# EAGLE design Gerador de Sinais (EAGLE 7.4.0)
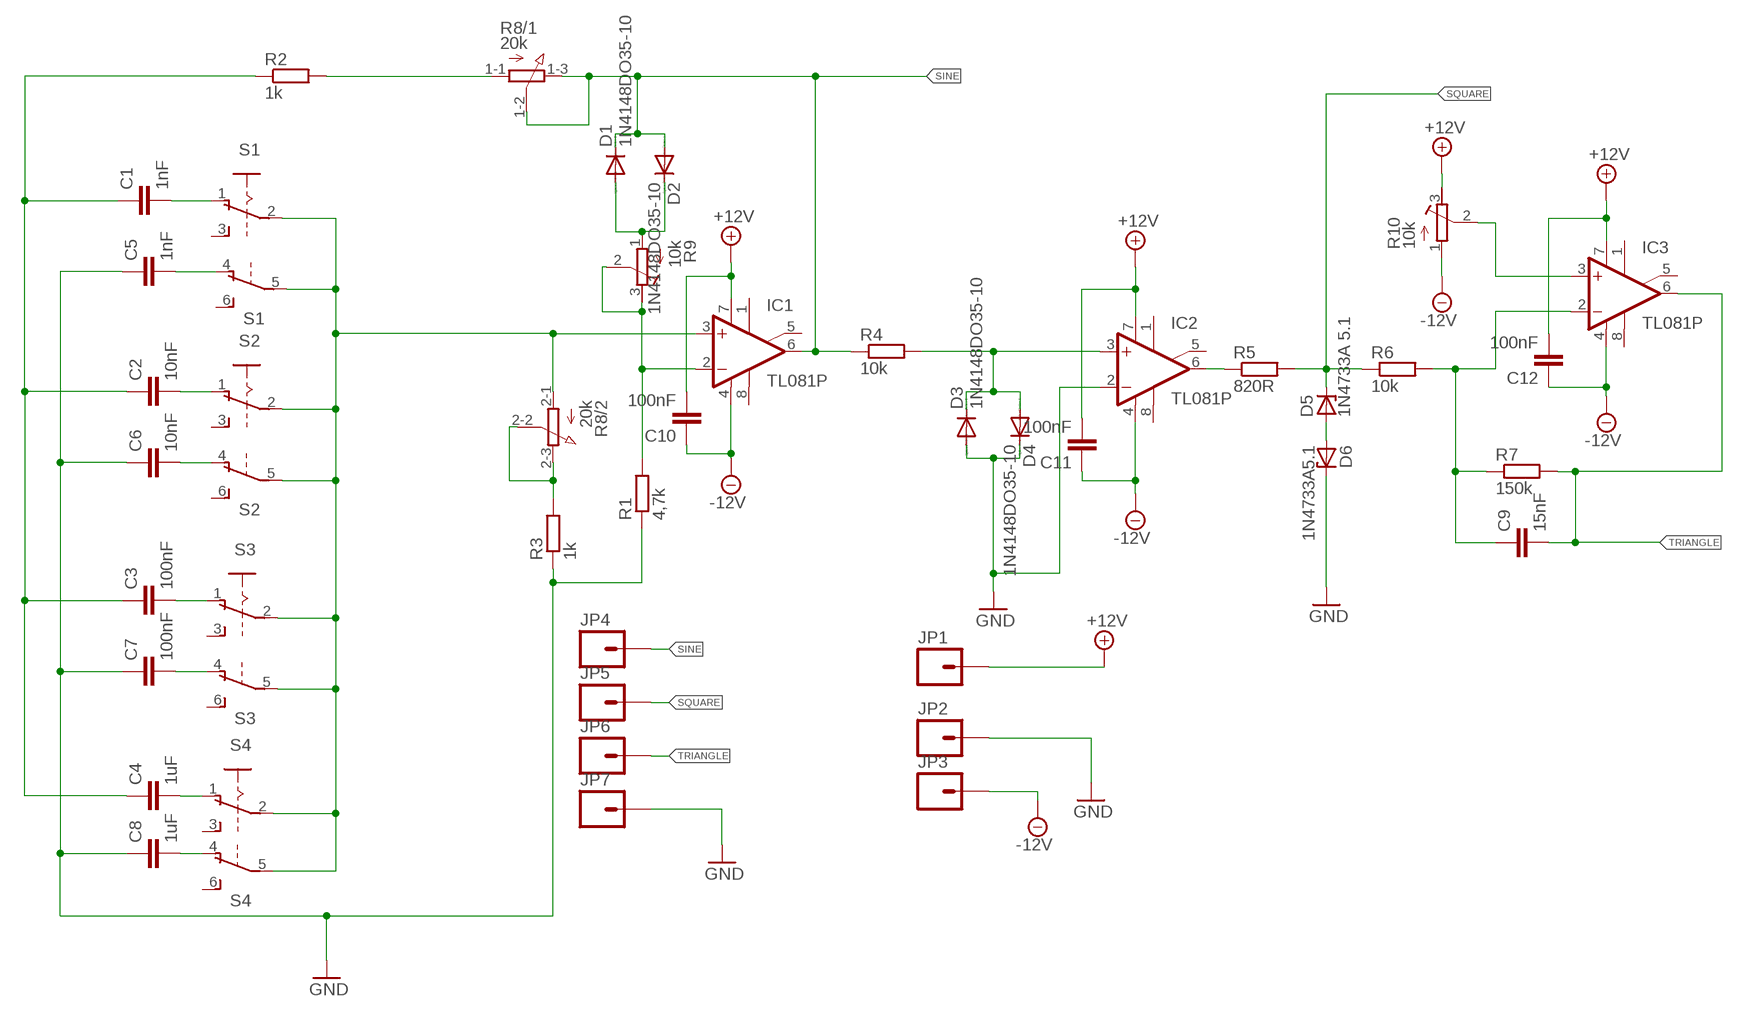
[diagram p0: schematic, sheet 1]

## Parts
C1  1nF  C-EU050-050X075  [C050-050X075]
C2  10nF  C-EU050-050X075  [C050-050X075]
C3  100nF  C-EU050-050X075  [C050-050X075]
C4  1uF  C-EU050-050X075  [C050-050X075]
C5  1nF  C-EU050-050X075  [C050-050X075]
C6  10nF  C-EU050-050X075  [C050-050X075]
C7  100nF  C-EU050-050X075  [C050-050X075]
C8  1uF  C-EU050-050X075  [C050-050X075]
C9  15nF  C-EU050-050X075  [C050-050X075]
C10  100nF  C-EU050-050X075  [C050-050X075]
C11  100nF  C-EU050-050X075  [C050-050X075]
C12  100nF  C-EU050-050X075  [C050-050X075]
D1  1N4148DO35-10  [DO35-10]
D2  1N4148DO35-10  [DO35-10]
D3  1N4148DO35-10  [DO35-10]
D4  1N4148DO35-10  [DO35-10]
D5  1N4733A 5.1  ZENER-DIODEZD-10  [ZDIO-10]
D6  1N4733A5.1  ZENER-DIODEZD-10  [ZDIO-10]
IC1  TL081P  [DIL08]
IC2  TL081P  [DIL08]
IC3  TL081P  [DIL08]
JP1  M01OFFSET  [1X01_OFFSET]
JP2  M01OFFSET  [1X01_OFFSET]
JP3  M01OFFSET  [1X01_OFFSET]
JP4  M01OFFSET  [1X01_OFFSET]
JP5  M01OFFSET  [1X01_OFFSET]
JP6  M01OFFSET  [1X01_OFFSET]
JP7  M01OFFSET  [1X01_OFFSET]
R1  4,7k  R-EU_0207/10  [0207/10]
R2  1k  R-EU_0207/10  [0207/10]
R3  1k  R-EU_0207/10  [0207/10]
R4  10k  R-EU_0207/10  [0207/10]
R5  820R  R-EU_0207/10  [0207/10]
R6  10k  R-EU_0207/10  [0207/10]
R7  150k  R-EU_0207/10  [0207/10]
R8  20k  3RP/1610G  [3RP/1610G]
R9  10k  R-TRIMM3296X  [RTRIM3296X]
R10  10k  R-TRIMM3296X  [RTRIM3296X]
S1  A68-A31  [A68-A31]
S2  A68-A31  [A68-A31]
S3  A68-A31  [A68-A31]
S4  A68-A31  [A68-A31]

## Nets
+12V: C10.2 C11.2 C12.2 IC1.7(V+) IC2.7(V+) IC3.7(V+) JP1.1 R10.3(E)
-12V: C10.1 C11.1 C12.1 IC1.4(V-) IC2.4(V-) IC3.4(V-) JP3.1 R10.1(A)
GND: C5.1 C6.1 C7.1 C8.1 D3.A D4.C D6.C IC2.2(-IN) JP2.1 JP7.1 R1.1 R3.1
N$1: IC1.2(-IN) R1.2 R9.2(S) R9.3(E)
N$2: D5.A D6.A
N$3: R3.2 R8.2-2(/2:S) R8.2-3(/2:E)
N$4: R2.2 R8.1-1(/1:A)
N$5: IC1.3(+IN) R8.2-1(/2:A) S1.2(A:P) S1.5(B:P) S2.2(A:P) S2.5(B:P) S3.2(A:P) S3.5(B:P) S4.2(A:P) S4.5(B:P)
N$6: D1.A D2.C R9.1(A)
N$8: C1.2 S1.1(A:O)
N$9: C5.2 S1.4(B:O)
N$10: C2.2 S2.1(A:O)
N$11: C6.2 S2.4(B:O)
N$12: C3.2 S3.1(A:O)
N$13: C4.2 S4.1(A:O)
N$14: C7.2 S3.4(B:O)
N$15: C8.2 S4.4(B:O)
N$16: C1.1 C2.1 C3.1 C4.1 R2.1
N$17: IC2.6(OUT) R5.1
N$19: D3.C D4.A IC2.3(+IN) R4.2
N$20: C9.1 IC3.2(-IN) R6.2 R7.1
N$21: IC3.3(+IN) R10.2(S)
SINE: D1.C D2.A IC1.6(OUT) JP4.1 R4.1 R8.1-2(/1:S) R8.1-3(/1:E)
SQUARE: D5.C JP5.1 R5.2 R6.1
TRIANGLE: C9.2 IC3.6(OUT) JP6.1 R7.2
Unconnected: IC1.1(ON1) IC1.5(ON2) IC1.8(OPT) IC2.1(ON1) IC2.5(ON2) IC2.8(OPT) IC3.1(ON1) IC3.5(ON2) IC3.8(OPT) S1.3(A:S) S1.6(B:S) S2.3(A:S) S2.6(B:S) S3.3(A:S) S3.6(B:S) S4.3(A:S) S4.6(B:S)

## Library data of the parts
C1-C12 = rcl:C-EU: CAPACITOR, European symbol
D1-D4 = diode:1N4148: DIODE high speed (Philips)
D5 D6 = diode:ZENER-DIODE: Z-Diode
IC1-IC3 = linear:TL081: OP AMP
JP1-JP7 = SparkFun-Connectors:M01: Header 1 Standard 1-pin 0.1" header. Use with straight break away headers (SKU : PRT-00116), right angle break away headers (PRT-00553), swiss pins (PRT-00743), machine pins (PRT-00117), and female headers (PRT-00115).
R1-R7 = resistor:R-EU_: RESISTOR, European symbol
R8 = pot:3RP/1610G: 16mm Potentiometer two level Source: http://www.alphapotentiometers.net/html/16mm_pot_2.html
R9 R10 = rcl:R-TRIMM: Trimm resistor
S1-S4 = switch:A68-A31: SLIDING SWITCH Siemens, distributor Buerklin, 11G766

## Board
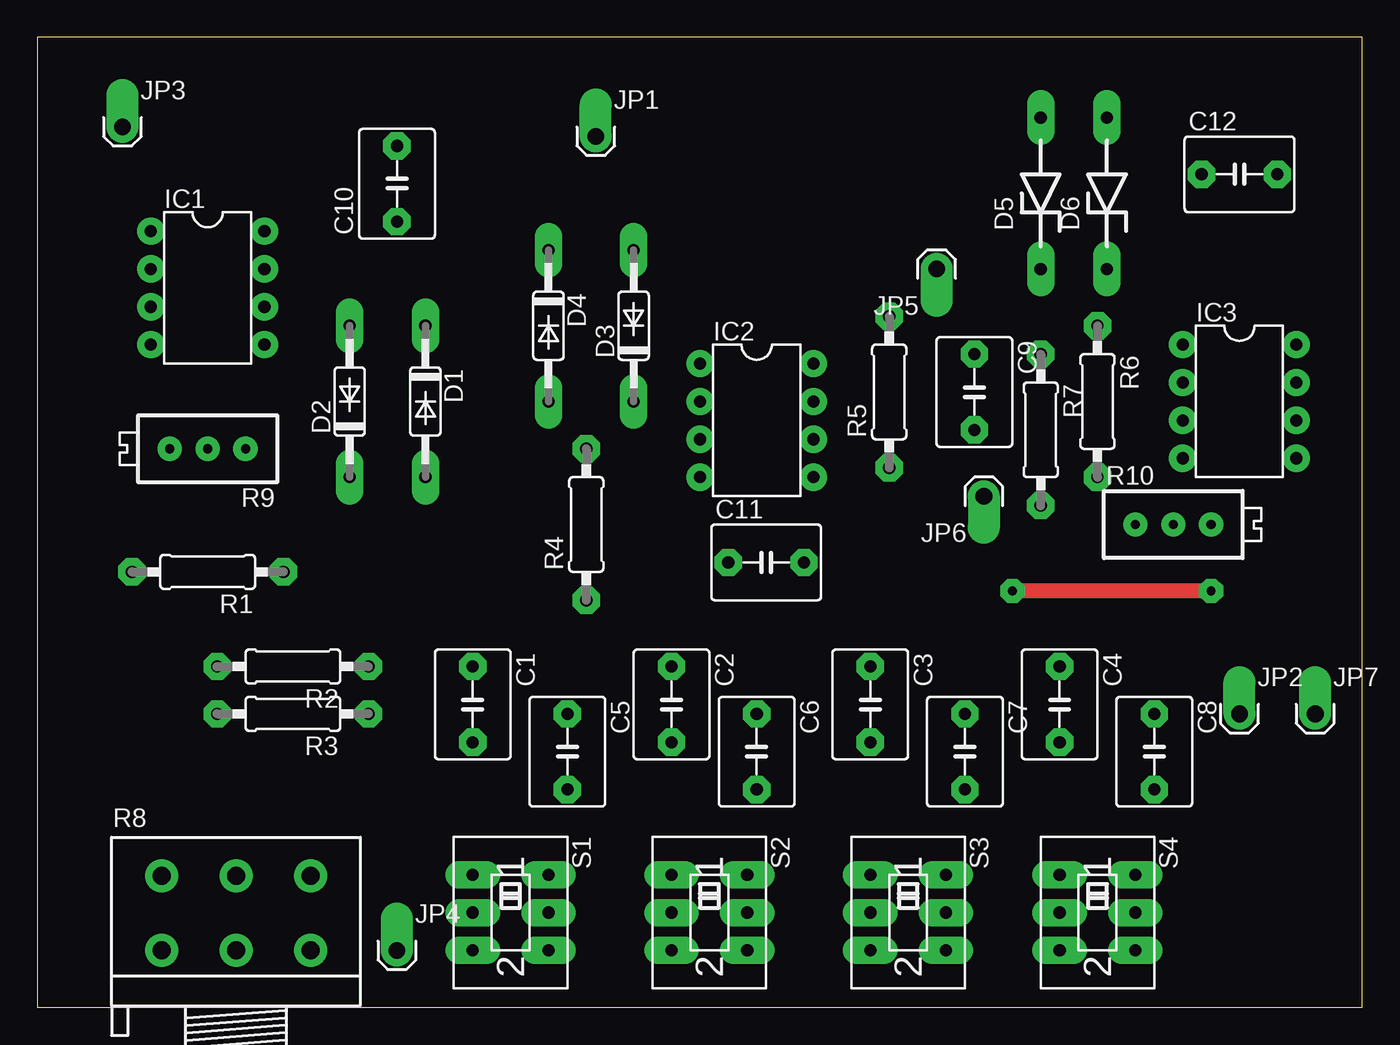
[diagram p1: board, top side]
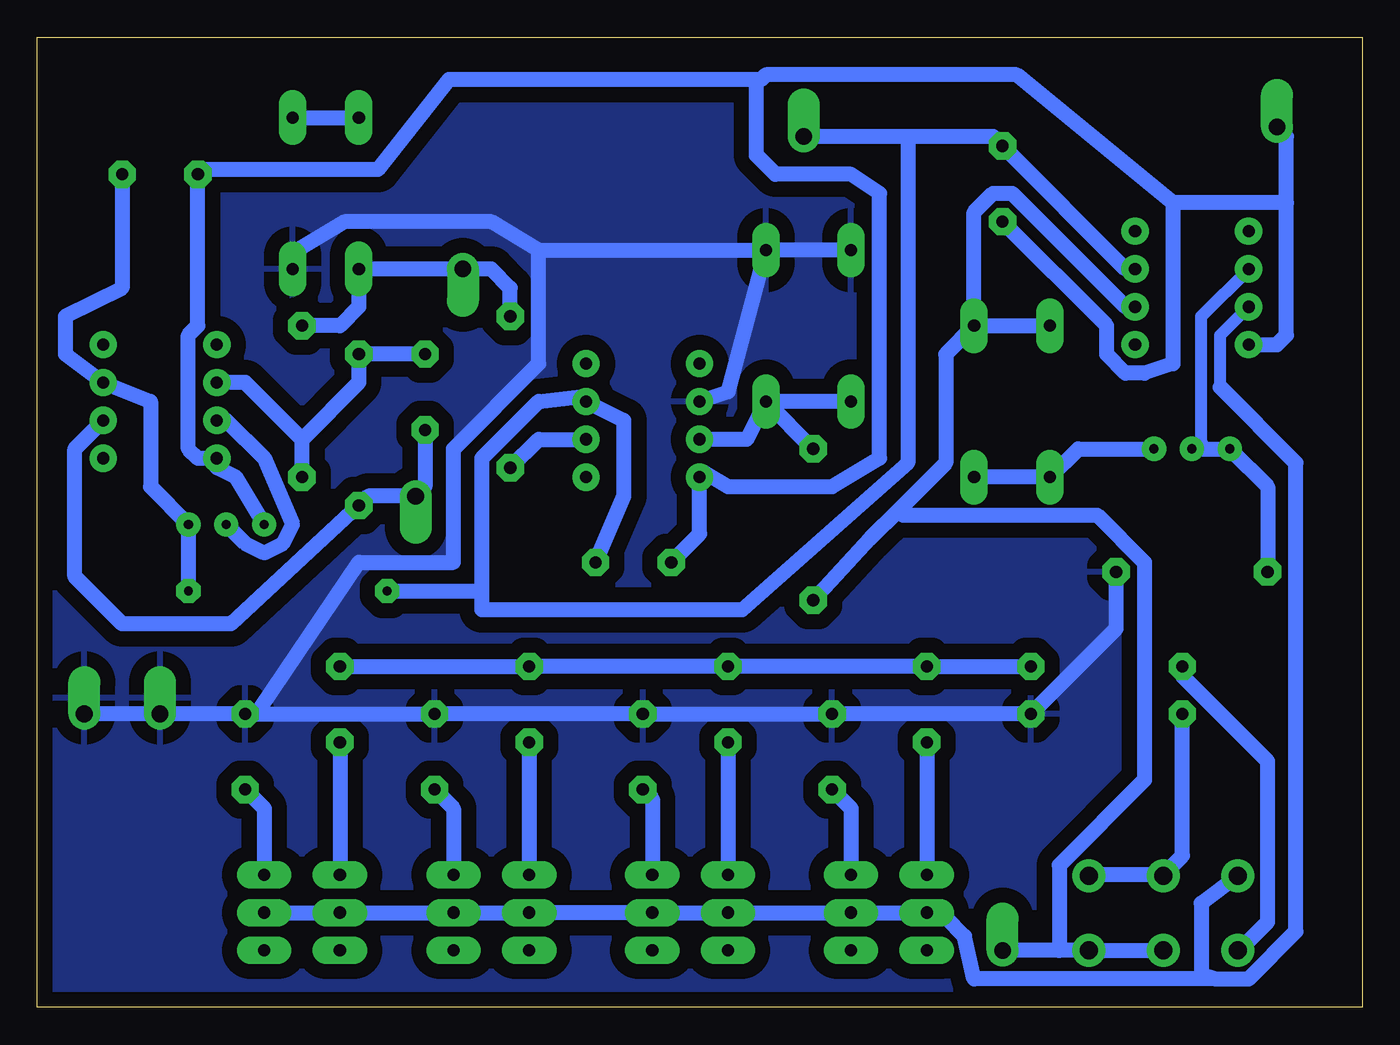
[diagram p2: board, bottom side, seen from below]

Size 88.88 x 65.08 mm. Coordinates in mm from the lower left corner, seen from the top.
Outline: 0,0 88.88,0 88.88,65.08 0,65.08 0,0
Copper layers (1*16): Top 0.035mm / dielectric 1.5mm / Bottom 0.035mm
Design rules "default": minimum track width 40mil, minimum drill 40mil, track to track 8mil, track to pad 8mil, pad to pad 8mil, via to via 8mil, smd to smd 8mil, copper to edge 40mil, drill to drill 8mil, minimum pad ring 20mil, minimum via ring 20mil, stop-mask expansion 4mil, vias tented up to drill 0mil, thermal gap 40mil

### Footprints (pad centres in the part's own frame; a part is rotated, then mirrored left to right if it is on the bottom)
C050-050X075 = drill 0.813 octagon: 1 -2.54,0; 2 2.54,0
DO35-10 = drill 0.813 long: A 5.08,0; C -5.08,0
ZDIO-10 = drill 0.813 long: A 5.08,0; C -5.08,0
DIL08 = drill 0.813 pad 1.27: 1 -3.81,-3.81; 2 -1.27,-3.81; 3 1.27,-3.81; 4 3.81,-3.81; 5 3.81,3.81; 6 1.27,3.81; 7 -1.27,3.81; 8 -3.81,3.81
1X01_OFFSET = drill 1.118 pad 1.88 offset: 1 0,0
0207/10 = drill 0.813 octagon: 1 -5.08,0; 2 5.08,0
3RP/1610G = drill 1.2 pad 2.184: 1-1 -5,0; 1-2 0,0; 1-3 5,0; 2-1 -5,5; 2-2 0,5; 2-3 5,5
RTRIM3296X = drill 0.61: 1 0,-2.54; 2 0,0; 3 0,2.54
A68-A31 = drill 0.813 long: 1 -2.54,-2.54; 2 0,-2.54; 3 2.54,-2.54; 4 -2.54,2.54; 5 0,2.54; 6 2.54,2.54

### Placement (x,y rotation side)
C1  29.21,20.32 270 top
C2  42.54,20.32 270 top
C3  55.88,20.32 270 top
C4  68.58,20.32 270 top
C5  35.56,17.14 270 top
C6  48.26,17.14 270 top
C7  62.23,17.14 270 top
C8  74.93,17.14 270 top
C9  62.86,41.27 270 top
C10  24.13,55.24 90 top
C11  48.89,29.84 0 top
C12  80.64,55.88 0 top
D1  26.04,40.64 270 top
D2  20.96,40.64 90 top
D3  40,45.72 90 top
D4  34.29,45.72 270 top
D5  67.31,54.61 90 top
D6  71.75,54.61 90 top
IC1  11.43,48.26 270 top
IC2  48.26,39.37 270 top
IC3  80.64,40.64 270 top
JP1  37.46,58.42 0 top
JP2  80.64,19.68 0 top
JP3  5.71,59.05 0 top
JP4  24.13,3.81 0 top
JP5  60.33,49.53 180 top
JP6  63.5,34.29 180 top
JP7  85.72,19.68 0 top
R1  11.43,29.21 180 top
R2  17.14,22.86 180 top
R3  17.14,19.68 180 top
R4  36.83,32.38 90 top
R5  57.15,41.27 90 top
R6  71.12,40.64 270 top
R7  67.31,38.73 270 top
R8  13.33,3.81 0 top
R9  11.43,37.47 90 top
R10  76.2,32.38 270 top
S1  31.75,6.35 270 top
S2  45.09,6.35 270 top
S3  58.42,6.35 270 top
S4  71.12,6.35 270 top

### Tracks (layer width: path | path; a pad name or v marks a point on that pad's centre or on a via)
+12V  (via drill 0.6)
  Top 1.016: v78.74,27.94 v65.41,27.94
  Bottom 1.016: IC1.7 15.87,49.53 C10.2 24.77,58.42 30.48,58.42 | 30.48,58.42 JP1.1 | 59.05,27.94 59.05,26.67 41.59,26.67 30.48,36.51 30.48,58.42 | 59.05,27.94 59.05,36.83 55.24,40.64 52.39,40.96 IC2.7 49.53,39.37 49.53,34.29 C11.2 | v78.74,27.94 R10.3 81.28,34.92 81.28,40.64 IC3.7 87,43.81 87,46.35 83.19,48.26 C12.2 | v65.41,27.94 59.05,27.94
-12V
  Bottom 1.016: C10.1 17.14,45.72 17.14,43.81 15.87,42.55 14.6,42.55 12.7,43.18 12.7,53.98 | 5.08,53.98 12.7,53.98 | 12.7,53.98 23.18,62.55 40,62.55 40.32,62.23 40.64,62.23 | 40.64,62.23 61.28,62.23 66.04,56.2 77.79,56.2 C12.1 78.11,45.72 78.74,45.09 78.74,37.47 78.11,36.83 IC3.4 76.83,36.2 75.56,35.56 R10.1 | C11.1 44.45,31.75 IC2.4 44.13,35.88 42.54,34.92 35.56,34.92 32.38,36.83 32.38,54.61 34.29,55.88 39.37,55.88 40.64,57.15 40.64,62.23 | IC1.4 5.71,44.45 5.08,45.09 5.08,53.98 | 5.08,53.98 5.08,58.42 JP3.1
GND
  Bottom 1.016: IC2.2 42.54,41.27 D3.A | D6.C 71.44,50.8 68.26,52.7 58.42,52.7 55.24,50.8 | 73.98,19.68 C8.1 JP2.1 JP7.1 | 73.98,19.68 C7.1 C6.1 C5.1 R3.1 16.51,25.4 R1.1 | 73.98,19.68 73.98,20 67.31,29.84 60.96,29.84 60.96,37.47 55.24,43.18 55.24,50.8 | D4.C D3.A | 55.24,50.8 D3.A
  pour Bottom (isolate 1.016): 0.64,64.77 0.64,0.64 87.63,0.64 88.27,0.64 88.27,64.77
N$1
  Bottom 0.813: IC1.2 10.79,46.35 10.79,37.78
  Bottom 1.016: R1.2 6.35,34.92 R9.3 R9.2 10.79,37.78
N$2
  Bottom 1.016: D6.A D5.A
N$3
  Bottom 1.016: R3.2 12.06,10.16 13.33,8.89 R8.2-2 13.65,8.89 18.1,8.89 R8.2-3
N$4
  Bottom 1.016: R2.2 12.06,22.23 6.35,16.51 6.35,5.71 8.25,3.81 R8.1-1
N$5
  Bottom 0.813: IC1.3 9.53,45.09 9.53,41.59
  Bottom 1.016: S4.5 S4.2 S3.5 S3.2 S2.5 S2.2 S1.5 S1.2 28.89,6.03 27.94,6.03 26.67,4.76 26.04,1.91 9.84,1.91 | 9.53,41.59 4.45,36.51 4.45,5.08 7.62,1.91 9.84,1.91 | R8.2-1 10.79,6.99 10.79,2.22 9.84,1.91
N$6
  Bottom 1.016: R9.1 19.05,37.47 D2.C D1.A
N$8
  Bottom 1.016: C1.2 S1.1
N$9
  Bottom 1.016: S1.4 34.29,13.34 C5.2
N$10
  Bottom 1.016: C2.2 S2.1
N$11
  Bottom 1.016: S2.4 47.62,13.97 C6.2
N$12
  Bottom 1.016: C3.2 S3.1
N$13
  Bottom 1.016: C4.2 S4.1
N$14
  Bottom 1.016: S3.4 60.96,13.34 C7.2
N$15
  Bottom 1.016: S4.4 73.66,13.34 C8.2
N$16
  Bottom 1.016: C4.1 C3.1 C2.1 C1.1 R2.1
N$17
  Bottom 1.016: IC2.6 55.24,38.1 R5.1
N$19
  Bottom 1.016: D4.A D3.C | D3.C R4.2 | D3.C 41.27,38.1 IC2.3
N$20
  Bottom 1.016: C9.1 R7.1 67.31,41.91 71.12,38.1 | R6.2 71.12,38.1 | 71.12,38.1 74.93,41.91 IC3.2
N$21
  Bottom 1.016: IC3.3 76.2,39.37 73.66,36.83 71.75,32.38 72.39,31.11 73.66,30.48 74.93,31.11 R10.2
SINE
  Bottom 1.016: 20.32,3.81 R8.1-3 R8.1-2 | 20.32,3.81 JP4.1 | D1.C D2.A | R4.1 33.02,31.43 31.11,33.34 | 31.11,33.34 27.94,36.51 27.94,43.81 D1.C | IC1.6 15.87,46.99 23.5,54.61 24.77,54.61 26.04,53.34 D1.C | 20.32,3.81 20.32,9.53 14.6,15.24 14.6,29.84 17.78,33.02 30.8,33.02 31.11,33.34
SQUARE
  Bottom 1.016: R5.2 57.15,48.26 58.42,49.53 JP5.1 D5.C 67.31,46.99 68.58,45.72 R6.1
TRIANGLE
  Bottom 1.016: IC3.6 86.36,37.47 86.36,28.89 83.19,25.72 75.88,25.72 R7.2 66.67,34.29 JP6.1 62.86,34.92 C9.2